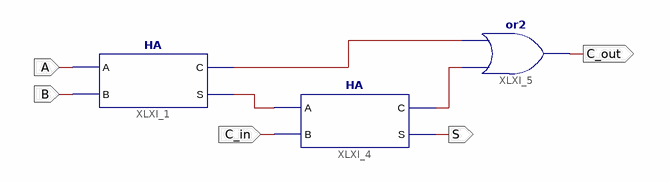
[diagram p0: schematic sheet 1]
// Xilinx ISE schematic FA.sch (spartan3e) as structural Verilog: 3 symbols, 5 ports
module FA (
  input  C_in,
  input  A,
  input  B,
  output S,
  output C_out
);

  wire XLXN_2, XLXN_6, XLXN_7;

  HA XLXI_1 (.A(A), .B(B), .C(XLXN_7), .S(XLXN_2));
  HA XLXI_4 (.A(XLXN_2), .B(C_in), .C(XLXN_6), .S(S));
  or XLXI_5 (C_out, XLXN_6, XLXN_7);
endmodule
